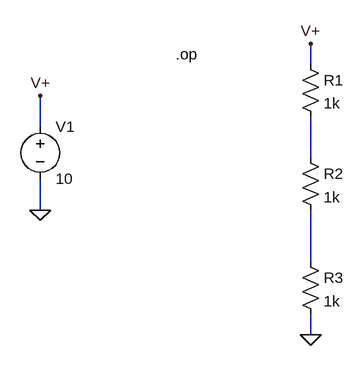
[diagram p0: schematic lab6a.asc]
lab6a.asc, the LTspice schematic file:
Version 4
SHEET 1 880 680
WIRE 368 192 368 160
WIRE -48 288 -48 240
WIRE 368 336 368 272
WIRE -48 416 -48 368
WIRE 368 496 368 416
WIRE 368 608 368 576
FLAG -48 416 0
FLAG -48 240 V+
FLAG 368 608 0
FLAG 368 160 V+
SYMBOL voltage -48 272 R0
SYMATTR InstName V1
SYMATTR Value 10
SYMBOL Res 352 176 R0
SYMATTR InstName R1
SYMATTR Value 1k
SYMBOL Res 352 320 R0
SYMATTR InstName R2
SYMATTR Value 1k
SYMBOL Res 352 480 R0
SYMATTR InstName R3
SYMATTR Value 1k
TEXT 160 176 Left 2 !.op

The netlist it stands for:
* lab6a.asc
V1 V+ 0 10
R1 V+ N001 1k
R2 N001 N002 1k
R3 N002 0 1k
.op
.backanno
.end